# Altium schematic sheet Sheet1.SchDoc
size A2
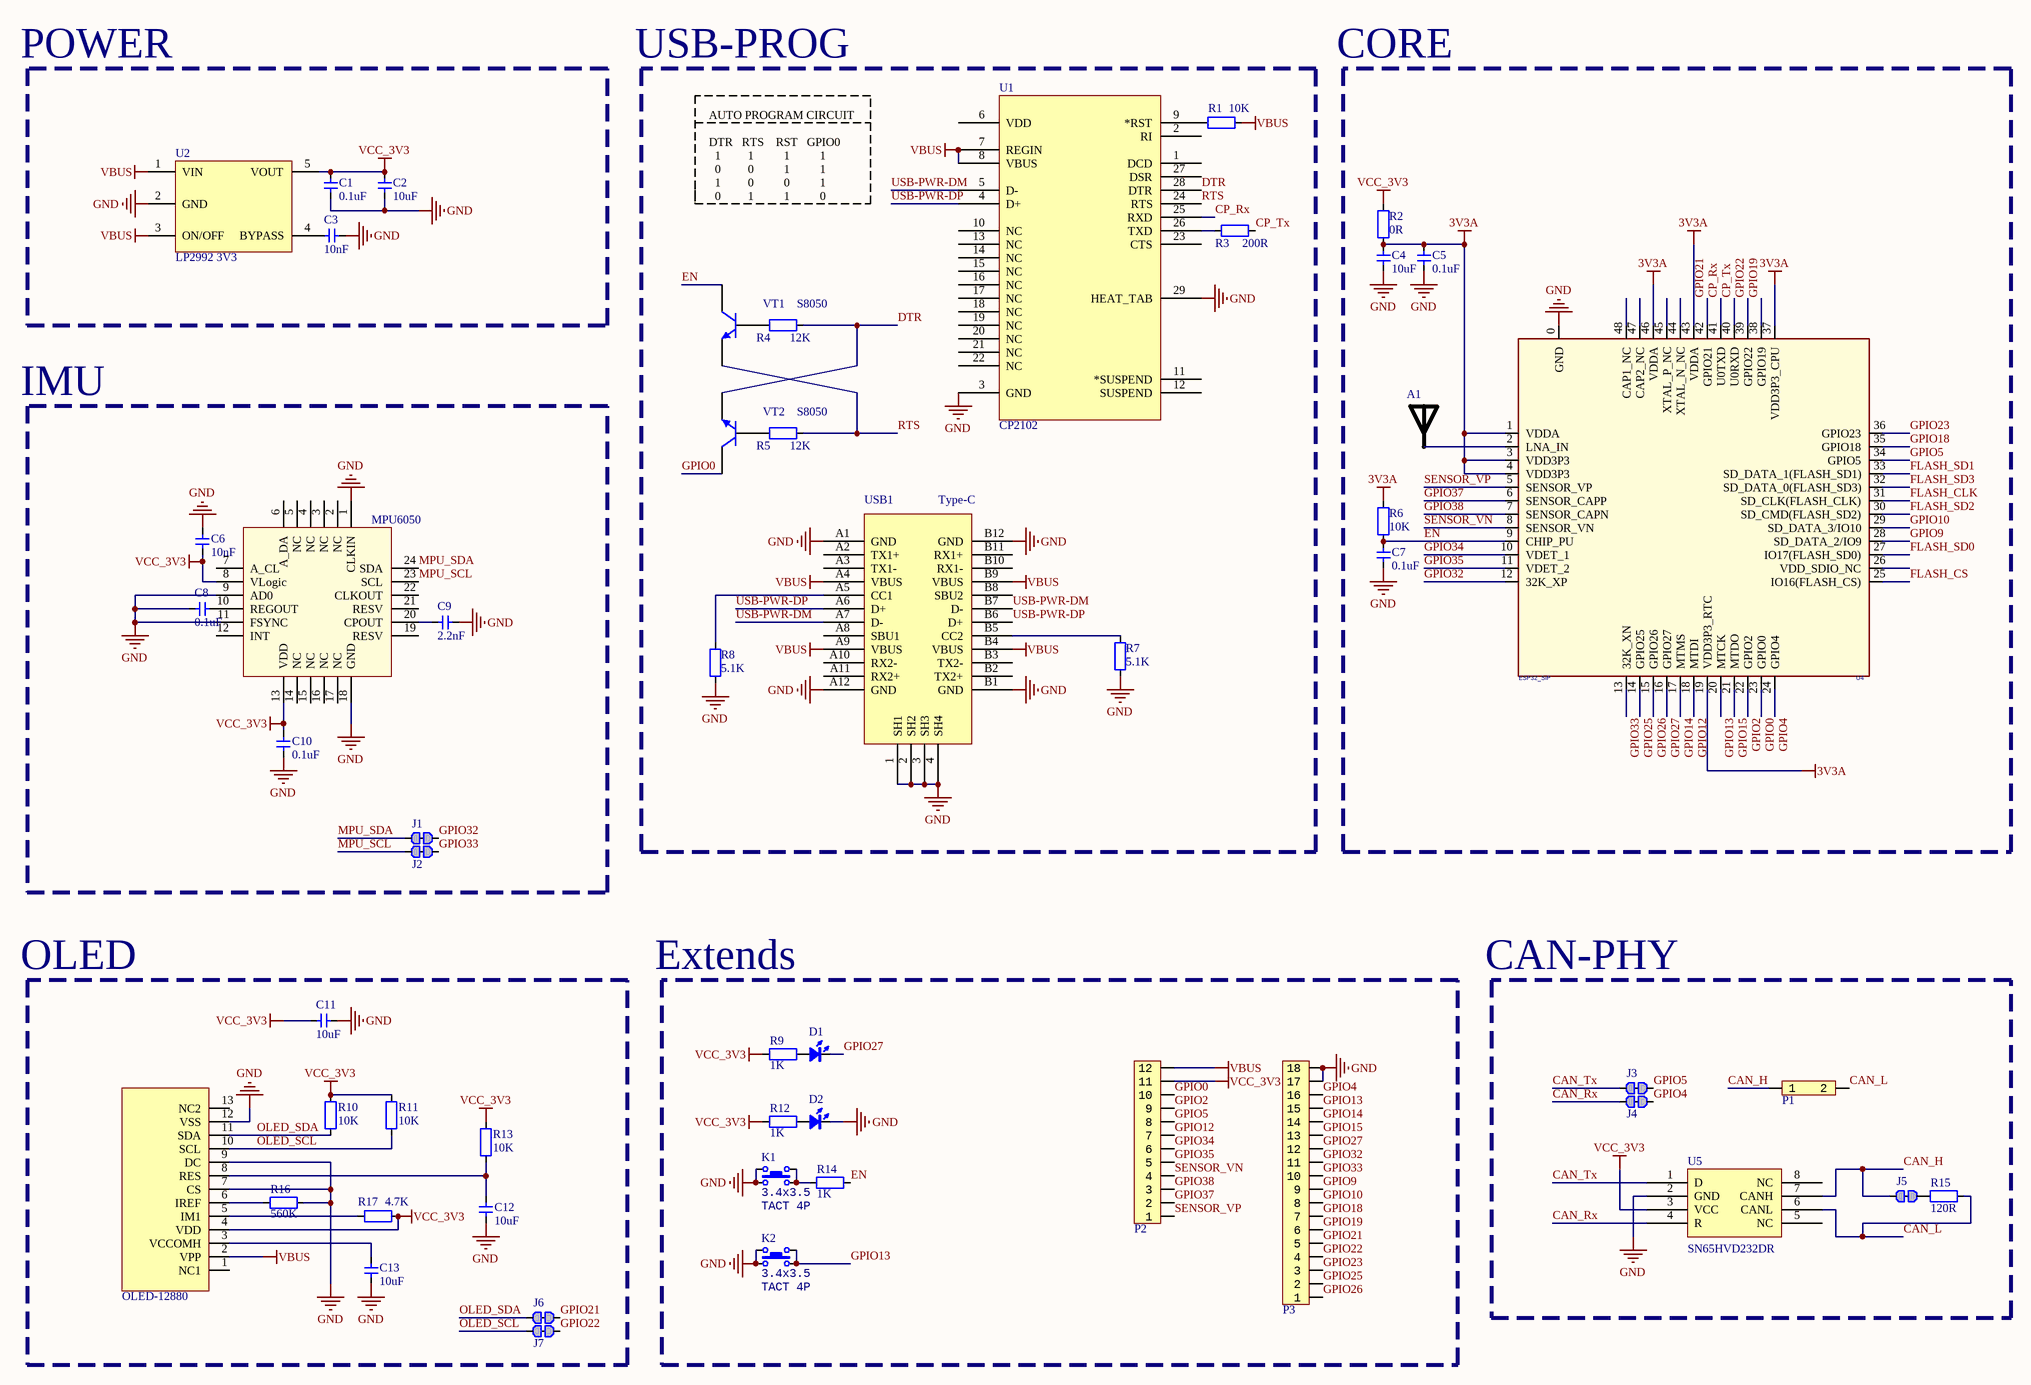
[diagram p0: Sheet1.SchDoc]

## Parts
1  OLED-12880  [OLED-12880]
A1  RAINSUN  [ANT-Rainsun-AN5120]  (value not drawn)
C1  0.1uF  [C0603]
C2  10uF  [C0603]
C3  10nF  [C0603]
C4  10uF  [C0603]
C5  0.1uF  [C0603]
C6  10nF  [C0603]
C7  0.1uF  [C0603]
C8  0.1uF  [C0603]
C9  2.2nF  [C0603]
C10  0.1uF  [C0603]
C11  10uF  [C0603]
C12  10uF  [C0603]
C13  10uF  [C0603]
D1  color?  [LED 0603]  (value not drawn)
D2  color?  [LED 0603]  (value not drawn)
J1  跳线  [R0603]  (value not drawn)
J2  跳线  [R0603]  (value not drawn)
J3  跳线  [R0603]  (value not drawn)
J4  跳线  [R0603]  (value not drawn)
J5  跳线  [R0603]  (value not drawn)
J6  跳线  [R0603]  (value not drawn)
J7  跳线  [R0603]  (value not drawn)
K1  value 3.4x3.5  [ButtonTACT_3.5*3.55_90]  (hidden comment: TACT 4P)
K2  value 3.4x3.5  [ButtonTACT_3.5*3.55_90]  (hidden comment: TACT 4P)
P1  HDR2x1_2.54  [HDR1X2_2.54_180]  (value not drawn)
P2  HDR1x12_2.54  [HDR1X12_2.54_180]  (value not drawn)
P3  HDR1x18_2.54  [HDR1X18_2.54_180]  (value not drawn)
R1  10K  [R0603]
R2  0R  [R0603]
R3  200R  [R0603]
R4  12K  [R0603]
R5  12K  [R0603]
R6  10K  [R0603]
R7  5.1K  [R0603]
R8  5.1K  [R0603]
R9  1K  [R0603]
R10  10K  [R0603]
R11  10K  [R0603]
R12  1K  [R0603]
R13  10K  [R0603]
R14  1K  [R0603]
R15  120R  [R0603]
R16  560K  [R0603]
R17  4.7K  [R0603]
U1  CP2102  [QFN-28]
U2  LP2992 3V3  [SOT23-5]
U3  MPU6050  [QFN-24]
U4  ESP32_SIP  [QFN-48_7X7]
U5  Manufacturer Part Number: SN65HVD232DR  [SO-8]  (hidden comment: SN65HVD232D)
USB1  Type-C  [Type-C-TOP]
VT1  S8050  [SMT_TRIODE_NPN]
VT2  S8050  [SMT_TRIODE_NPN]

## Nets
3V3A: C4.2 C5.2 R2.2 R6.1 U4.1(VDDA) U4.3(VDD3P3) U4.4(VDD3P3) U4.19(VDD3P3_RTC) U4.37(VDD3P3_CPU) U4.43(VDDA) U4.46(VDDA)
GND: 1.7(CS) 1.9(DC) 1.12(VSS) C1.1 C2.1 C3.1 C4.1 C5.1 C6.2 C7.2 C8.2 C9.1 C10.1 C11.1 C12.1 C13.1 D2.2(K) K1.1 K1.3 K2.1 K2.3 P3.17 P3.18 R7.2 R8.2 R16.2 U1.3(GND) U1.29(HEAT_TAB) U2.2(GND) U3.1(CLKIN) U3.9(AD0) U3.11(FSYNC) U3.18(GND) U4.0(GND) U5.2(GND) USB1.1(SH1) USB1.2(SH2) USB1.3(SH3) USB1.4(SH4) USB1.A1(GND) USB1.A12(GND) USB1.B1(GND) USB1.B12(GND)
VBUS: 1.2(VPP) P2.12 R1.1 U1.7(REGIN) U1.8(VBUS) U2.1(VIN) U2.3(ON/OFF) USB1.A4(VBUS) USB1.A9(VBUS) USB1.B4(VBUS) USB1.B9(VBUS)
VCC_3V3: 1.4(VDD) C1.2 C2.2 C6.1 C10.2 C11.2 P2.11 R2.1 R9.1 R10.2 R11.2 R12.1 R13.2 R17.2 U2.5(VOUT) U3.8(VLogic) U3.13(VDD) U5.3(VCC)
CAN_H: J5.1 P1.1 U5.7(CANH)
CAN_L: P1.2 R15.2 U5.6(CANL)
CAN_Rx: J4.1 U5.4(R)
CAN_Tx: J3.1 U5.1(D)
CP_Rx: U1.25(RXD) U4.41(U0TXD)
CP_Tx: R3.1 U4.40(U0RXD)
DTR: R4.1 U1.28(DTR) VT2.2(E)
EN: C7.1 R6.2 R14.2 U4.9(CHIP_PU) VT1.3(C)
FLASH_CLK: U4.31(SD_CLK(FLASH_CLK))
FLASH_CS: U4.25(IO16(FLASH_CS))
FLASH_SD0: U4.27(IO17(FLASH_SD0))
FLASH_SD1: U4.33(SD_DATA_1(FLASH_SD1))
FLASH_SD2: U4.30(SD_CMD(FLASH_SD2))
FLASH_SD3: U4.32(SD_DATA_0(FLASH_SD3))
GPIO0: P2.10 U4.23(GPIO0) VT2.3(C)
GPIO2: P2.9 U4.22(GPIO2)
GPIO4: J4.2 P3.16 U4.24(GPIO4)
GPIO5: J3.2 P2.8 U4.34(GPIO5)
GPIO9: P3.9 U4.28(SD_DATA_2/IO9)
GPIO10: P3.8 U4.29(SD_DATA_3/IO10)
GPIO12: P2.7 U4.18(MTDI)
GPIO13: K2.2 K2.4 P3.15 U4.20(MTCK)
GPIO14: P3.14 U4.17(MTMS)
GPIO15: P3.13 U4.21(MTDO)
GPIO18: P3.7 U4.35(GPIO18)
GPIO19: P3.6 U4.38(GPIO19)
GPIO21: J6.2 P3.5 U4.42(GPIO21)
GPIO22: J7.2 P3.4 U4.39(GPIO22)
GPIO23: P3.3 U4.36(GPIO23)
GPIO25: P3.2 U4.14(GPIO25)
GPIO26: P3.1 U4.15(GPIO26)
GPIO27: D1.2(K) P3.12 U4.16(GPIO27)
GPIO32: J1.2 P3.11 U4.12(32K_XP)
GPIO33: J2.2 P3.10 U4.13(32K_XN)
GPIO34: P2.6 U4.10(VDET_1)
GPIO35: P2.5 U4.11(VDET_2)
GPIO37: P2.2 U4.6(SENSOR_CAPP)
GPIO38: P2.3 U4.7(SENSOR_CAPN)
MPU_SCL: J2.1 U3.23(SCL)
MPU_SDA: J1.1 U3.24(SDA)
OLED_SCL: 1.10(SCL) J7.1 R11.1
OLED_SDA: 1.11(SDA) J6.1 R10.1
RTS: R5.1 U1.24(RTS) VT1.2(E)
SENSOR_VN: P2.4 U4.8(SENSOR_VN)
SENSOR_VP: P2.1 U4.5(SENSOR_VP)
USB-PWR-DM: U1.5(D-) USB1.A7(D-) USB1.B7(D-)
USB-PWR-DP: U1.4(D+) USB1.A6(D+) USB1.B6(D+)
Net1_3: 1.3(VCCOMH) C13.2
Net1_5: 1.5(IM1) R17.1
Net1_6: 1.6(IREF) R16.1
Net1_8: 1.8(RES) C12.2 R13.1
NetA1_1: A1.1 U4.2(LNA_IN)
NetC3_2: C3.2 U2.4(BYPASS)
NetC8_1: C8.1 U3.10(REGOUT)
NetC9_2: C9.2 U3.20(CPOUT)
NetD1_1: D1.1(A) R9.2
NetD2_1: D2.1(A) R12.2
NetJ5_2: J5.2 R15.1
NetK1_2: K1.2 K1.4 R14.1
NetR1_2: R1.2 U1.9(*RST)
NetR3_2: R3.2 U1.26(TXD)
NetR4_2: R4.2 VT1.1(B)
NetR5_2: R5.2 VT2.1(B)
NetR7_1: R7.1 USB1.B5(CC2)
NetR8_1: R8.1 USB1.A5(CC1)

Not connected (* = marked no-connect by the designer): 1 1(NC1) 13(NC2); U1 1(DCD) 2(RI) 6(VDD) 10(NC) 11(*SUSPEND) 12(SUSPEND) 13(NC) 14(NC) 15(NC) 16(NC) 17(NC) 18(NC) 19(NC) 20(NC) 21(NC) 22(NC) 23(CTS) 27(DSR); U3 2(NC) 3(NC) 4(NC) 5(NC) 6(A_DA) 7(A_CL) 12(INT) 14(NC) 15(NC) 16(NC) 17(NC) 19(RESV) 21(RESV) 22(CLKOUT); U4 26(VDD_SDIO_NC) 44(XTAL_N_NC) 45(XTAL_P_NC) 47(CAP2_NC) 48(CAP1_NC); U5 5(NC) 8(NC); USB1 A2(TX1+) A3(TX1-) A8(SBU1) A10(RX2-) A11(RX2+) B2(TX2+) B3(TX2-) B8(SBU2) B10(RX1-) B11(RX1+)

## Notes on the sheet
- POWER
- USB-PROG
- CORE
- AUTO PROGRAM CIRCUIT
  DTR   RTS    RST   GPIO0
  1         1          1          1
  0         0          1          1
  1         0          0          1
  0         1          1          0
- IMU
- OLED
- Extends
- CAN-PHY

## Library data of the parts
A1 = ANT-Rainsun-AP5120
C1-C13 = 电容-0402: Capacitor; Value: 0.1u
D1 D2 = LED_0402: LED; Type: 0402; Value: color?
J1-J7 = 跳线: Resistor; Published: 8-Jun-2000; LatestRevisionDate: 17-Jul-2002; LatestRevisionNote: Re-released for DXP Platform.; PackageReference: AXIAL-0.4; Publisher: Altium Limited; PackageDescription: Axial Device, Thru-Hole; 2 Leads; 0.4 in Pin Spacing
K1 K2 = ButtonTACT: Button; type: TACT 4P
P1 = HDR2x1_2.54: Header
P2 = HDR1x12_2.54: Header
P3 = HDR1x18_2.54: Header
R1-R17 = 电阻-0402: Resistor; Value: 22R
U1 = CP2102: USB转TTL; PART DESC: SINGLE-CHIP USB TO UART BRIDGE, QFN28, RoHS.; MFG #1: SILICON LABS; PART NUMBER: CP2102; Value: Value; RefDes: RefDes; Type: DEV
U2 = LP2992: LDO
U3 = MPU6050: 六轴传感器
U4 = ESP32-PICO
U5 = SN65HVD232D: Manufacturer: Texas Instruments; Protocol: CAN; Number of Drivers/Receivers: 1/1; Duplex: Half; Data Rate: 1Mbps; Voltage - Supply: 3 V ~ 3.6 V; Supplier 1: Digi-Key; Supplier Part Number 1: 296-26344-2-ND; RoHS: RoHS Compliant; Category: Integrated Circuits (ICs); Stock: 5000; Pricing 1: 2500=0.84375 (USD); Packaging: Tape & Reel (TR); Part Status: Active; Type: Transceiver; Operating Temperature: -40°C ~ 85°C; Mounting Type: Surface Mount; Package / Case: 8-SOIC (0.154", 3.90mm Width); Supplier Device Package: 8-SOIC; ComponentLink1URL: http://www.ti.com/lit/ds/symlink/sn65hvd230.pdf; ComponentLink1Description: http://www.ti.com/lit/ds/symlink/sn65hvd230.pdf; Supplier 2: Digi-Key; Supplier Part Number 2: 296-26344-1-ND; Pricing 2: 1=2.05, 10=1.842, 100=1.4809, 500=1.21668, 1000=1.00811 (USD)
USB1 = USB-Type-C-TOP
VT1 VT2 = SMT_TRIODE_NPN: Surface mount NPN transistor, package SOT-23